# EAGLE schematic main (EAGLE 7.2.0)
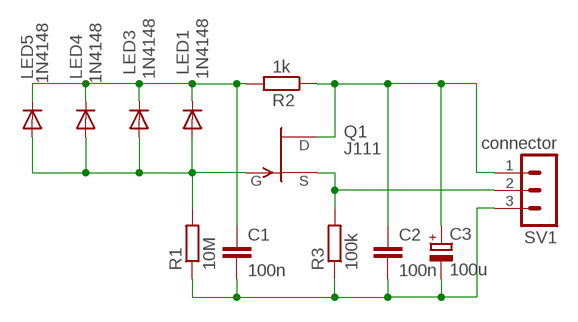
[diagram p0: schematic, sheet 1]

## Parts
C1  100n  C-EUC1206  [C1206]
C2  100n  C-EUC1206  [C1206]
C3  100u  CPOL-EUSMCC  [SMC_C]
LED1  1N4148  1N4148DO35-7  [DO35-7]
LED3  1N4148  1N4148DO35-7  [DO35-7]
LED4  1N4148  1N4148DO35-7  [DO35-7]
LED5  1N4148  1N4148DO35-7  [DO35-7]
Q1  J111  SST201  [SOT23]
R1  10M  R-EU_0207/10  [0207/10]
R2  1k  R-EU_R1206  [R1206]
R3  100k  R-EU_R1206  [R1206]
SV1  connector  MA03-1  [MA03-1]

## Nets
GND: C1.2 C2.2 C3.- R1.1 R3.1 SV1.3
N$1: C1.1 LED1.C LED3.C LED4.C LED5.C R2.2
N$2: Q1.2(S) R3.2 SV1.2
N$4: LED1.A LED3.A LED4.A LED5.A Q1.3(G) R1.2
N$6: C2.1 C3.+ Q1.1(D) R2.1 SV1.1

## Library data of the parts
C1 C2 = resistor:C-EU: CAPACITOR, European symbol
C3 = resistor:CPOL-EU: POLARIZED CAPACITOR, European symbol
LED1 LED3-LED5 = diode:1N4148: DIODE high speed (Philips)
Q1 = transistor-fet:?20*: TEMIC / Siliconix N-Channel JFET Source: JFET-J201_Siliconix_data.pdf
R1-R3 = resistor:R-EU_: RESISTOR, European symbol
SV1 = con-lstb:MA03-1: PIN HEADER; OC_FARNELL: unknown; OC_NEWARK: unknown

## Net classes
0 default: width 0.508 mm